# EAGLE design pi-board-v1 (EAGLE 8.7.1)
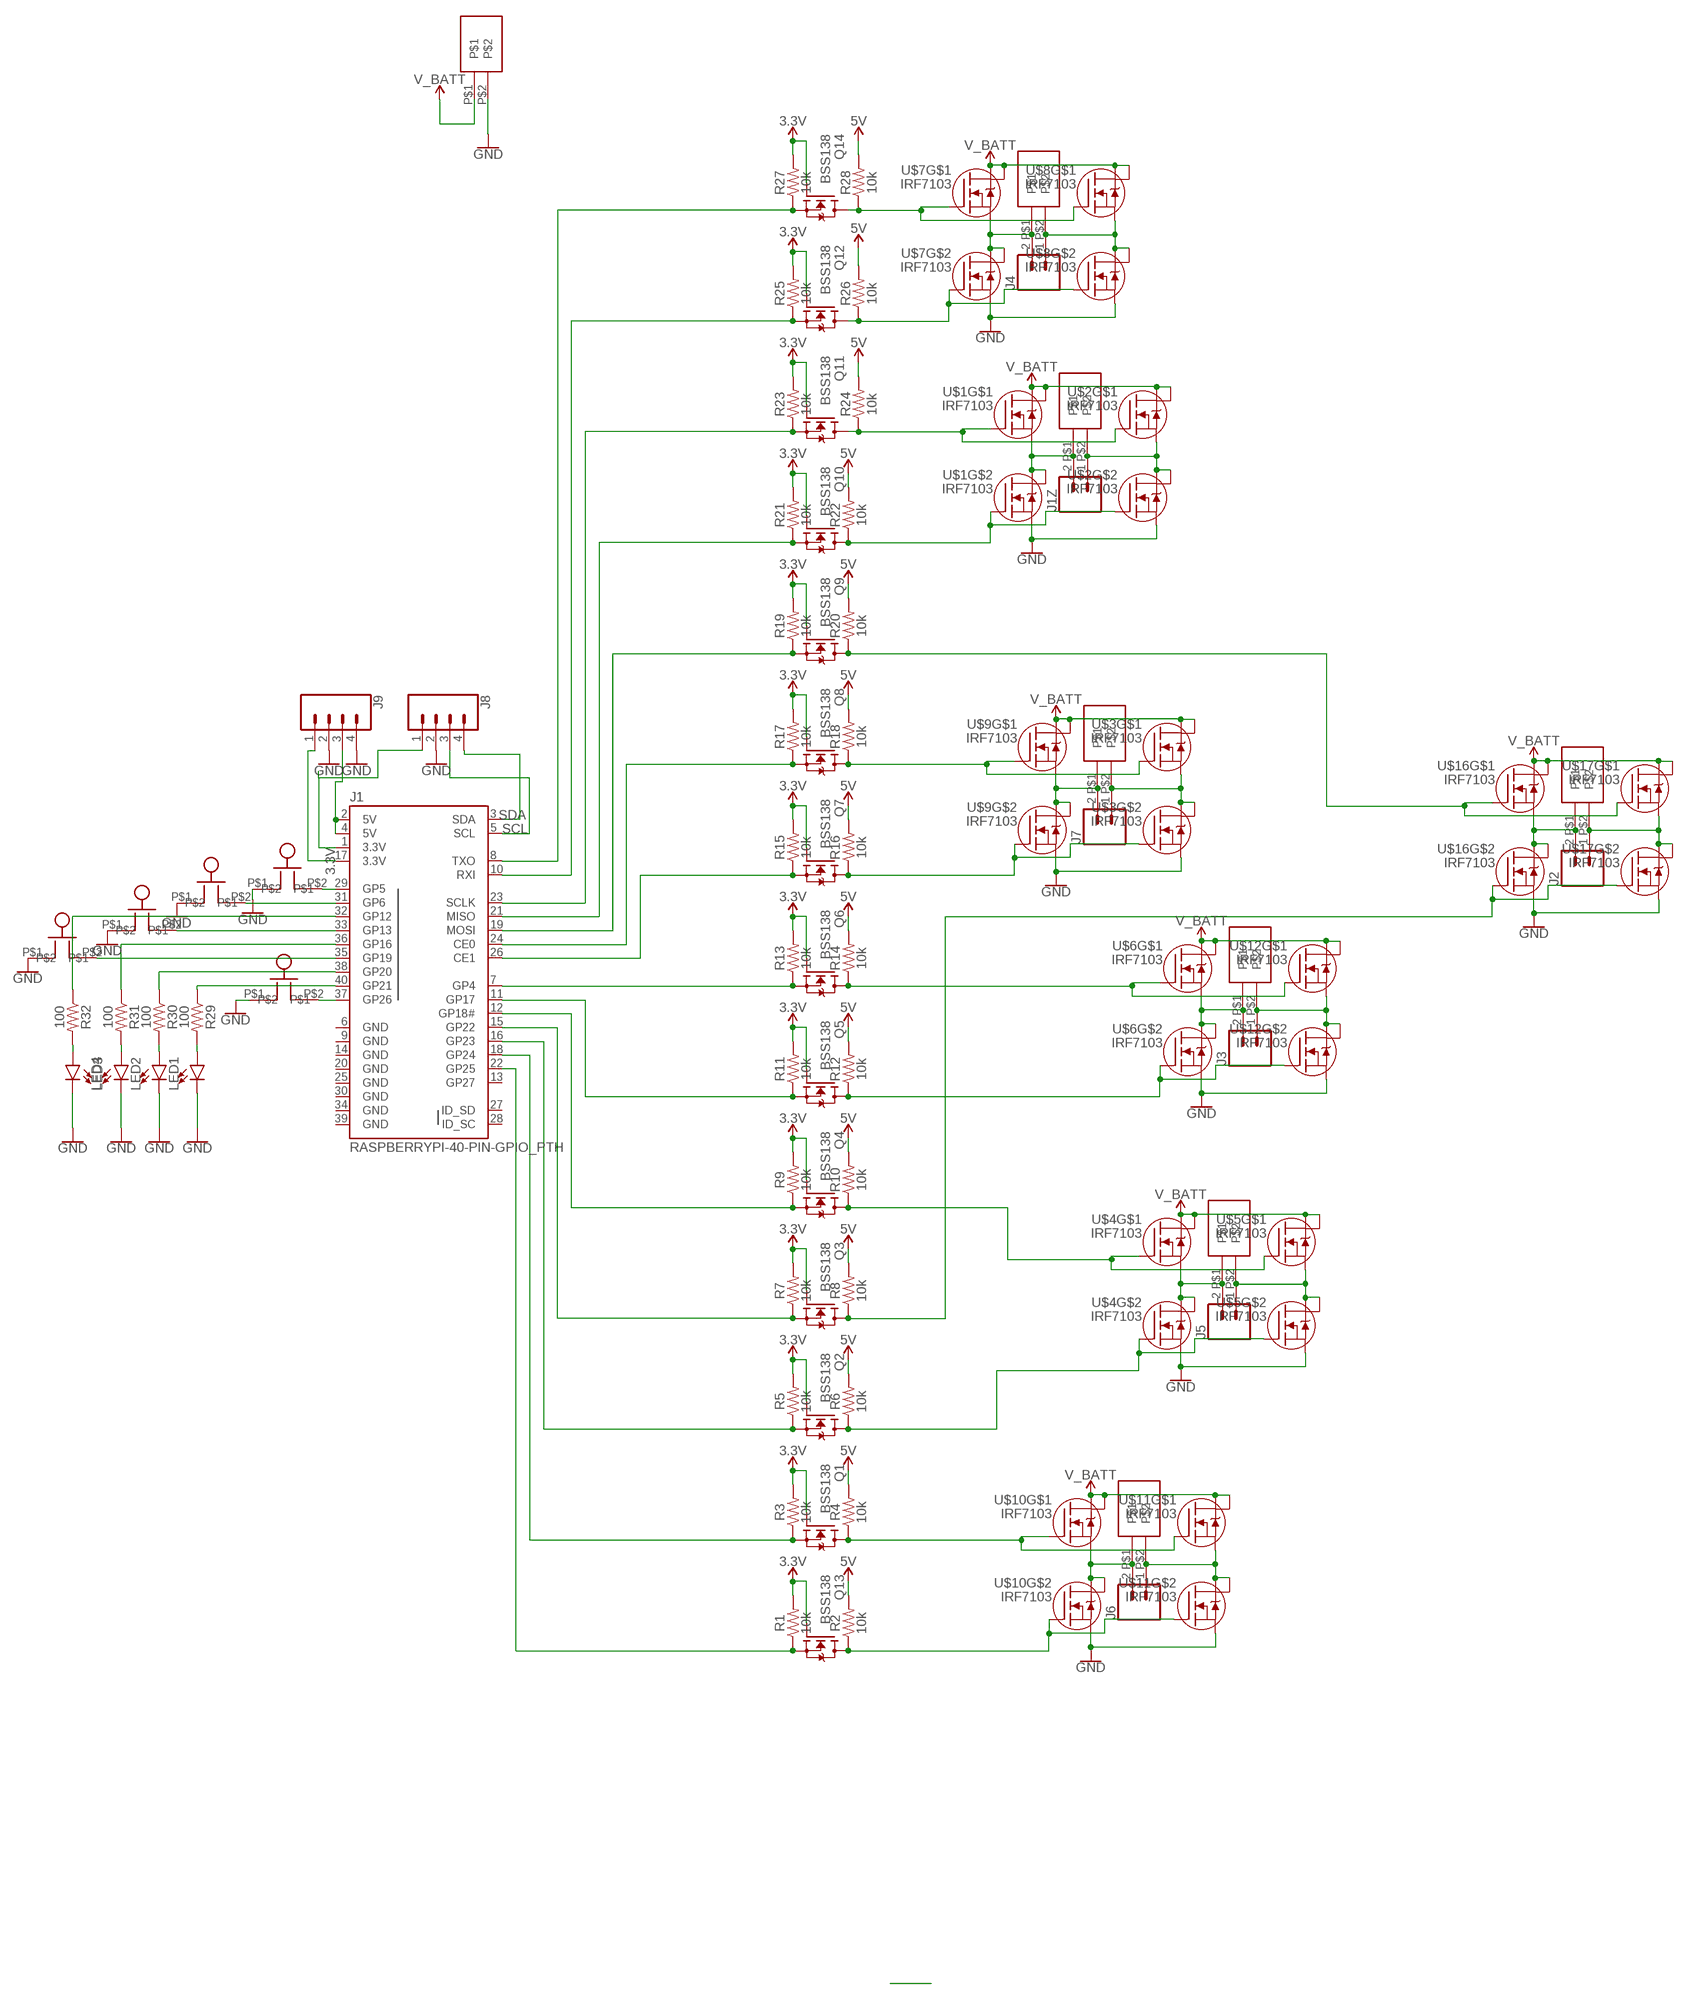
[diagram p0: schematic, sheet 1]

## Parts
B1  BUTTON  [BUTTON]
B2  BUTTON  [BUTTON]
B3  BUTTON  [BUTTON]
B4  BUTTON  [BUTTON]
B5  BUTTON  [BUTTON]
J1  RASPBERRYPI-40-PIN-GPIO_PTH  [2X20_SHROUDED]
J1Z  CONN_02  [1X02]
J2  CONN_02  [1X02]
J3  CONN_02  [1X02]
J4  CONN_02  [1X02]
J5  CONN_02  [1X02]
J6  CONN_02  [1X02]
J7  CONN_02  [1X02]
J8  CONN_04  [1X04]
J9  CONN_04  [1X04]
LED1  LED-3MM-NO_SILK  [LED_3MM-NS]
LED2  LED-3MM-NO_SILK  [LED_3MM-NS]
LED3  LED-3MM-NO_SILK  [LED_3MM-NS]
LED4  LED-3MM-NO_SILK  [LED_3MM-NS]
Q1  BSS138  [SOT23]
Q2  BSS138  [SOT23]
Q3  BSS138  [SOT23]
Q4  BSS138  [SOT23]
Q5  BSS138  [SOT23]
Q6  BSS138  [SOT23]
Q7  BSS138  [SOT23]
Q8  BSS138  [SOT23]
Q9  BSS138  [SOT23]
Q10  BSS138  [SOT23]
Q11  BSS138  [SOT23]
Q12  BSS138  [SOT23]
Q13  BSS138  [SOT23]
Q14  BSS138  [SOT23]
R1  10k  10KOHM-0603-1/10W-1%  [0603]
R2  10k  10KOHM-0603-1/10W-1%  [0603]
R3  10k  10KOHM-0603-1/10W-1%  [0603]
R4  10k  10KOHM-0603-1/10W-1%  [0603]
R5  10k  10KOHM-0603-1/10W-1%  [0603]
R6  10k  10KOHM-0603-1/10W-1%  [0603]
R7  10k  10KOHM-0603-1/10W-1%  [0603]
R8  10k  10KOHM-0603-1/10W-1%  [0603]
R9  10k  10KOHM-0603-1/10W-1%  [0603]
R10  10k  10KOHM-0603-1/10W-1%  [0603]
R11  10k  10KOHM-0603-1/10W-1%  [0603]
R12  10k  10KOHM-0603-1/10W-1%  [0603]
R13  10k  10KOHM-0603-1/10W-1%  [0603]
R14  10k  10KOHM-0603-1/10W-1%  [0603]
R15  10k  10KOHM-0603-1/10W-1%  [0603]
R16  10k  10KOHM-0603-1/10W-1%  [0603]
R17  10k  10KOHM-0603-1/10W-1%  [0603]
R18  10k  10KOHM-0603-1/10W-1%  [0603]
R19  10k  10KOHM-0603-1/10W-1%  [0603]
R20  10k  10KOHM-0603-1/10W-1%  [0603]
R21  10k  10KOHM-0603-1/10W-1%  [0603]
R22  10k  10KOHM-0603-1/10W-1%  [0603]
R23  10k  10KOHM-0603-1/10W-1%  [0603]
R24  10k  10KOHM-0603-1/10W-1%  [0603]
R25  10k  10KOHM-0603-1/10W-1%  [0603]
R26  10k  10KOHM-0603-1/10W-1%  [0603]
R27  10k  10KOHM-0603-1/10W-1%  [0603]
R28  10k  10KOHM-0603-1/10W-1%  [0603]
R29  100  10KOHM-0603-1/10W-1%  [0603]
R30  100  10KOHM-0603-1/10W-1%  [0603]
R31  100  10KOHM-0603-1/10W-1%  [0603]
R32  100  10KOHM-0603-1/10W-1%  [0603]
U$1  IRF7103  [SO8-2]
U$2  IRF7103  [SO8-2]
U$3  IRF7103  [SO8-2]
U$4  IRF7103  [SO8-2]
U$5  IRF7103  [SO8-2]
U$6  IRF7103  [SO8-2]
U$7  IRF7103  [SO8-2]
U$8  IRF7103  [SO8-2]
U$9  IRF7103  [SO8-2]
U$10  IRF7103  [SO8-2]
U$11  IRF7103  [SO8-2]
U$12  IRF7103  [SO8-2]
U$16  IRF7103  [SO8-2]
U$17  IRF7103  [SO8-2]
U$22  SPRING-TERMINAL  [SPRING-TERMINAL]
X1  SPRING-TERMINAL  [SPRING-TERMINAL]
X2  SPRING-TERMINAL  [SPRING-TERMINAL]
X3  SPRING-TERMINAL  [SPRING-TERMINAL]
X4  SPRING-TERMINAL  [SPRING-TERMINAL]
X5  SPRING-TERMINAL  [SPRING-TERMINAL]
X6  SPRING-TERMINAL  [SPRING-TERMINAL]
X7  SPRING-TERMINAL  [SPRING-TERMINAL]

## Nets
3.3V: J1.1(3.3V) J1.17(3.3V) J8.1 J9.1 Q1.1(G) Q2.1(G) Q3.1(G) Q4.1(G) Q5.1(G) Q6.1(G) Q7.1(G) Q8.1(G) Q9.1(G) Q10.1(G) Q11.1(G) Q12.1(G) Q13.1(G) Q14.1(G) R1.2 R3.2 R5.2 R7.2 R9.2 R11.2 R13.2 R15.2 R17.2 R19.2 R21.2 R23.2 R25.2 R27.2
5V: J1.2(5V) J1.4(5V) J9.3 R2.2 R4.2 R6.2 R8.2 R10.2 R12.2 R14.2 R16.2 R18.2 R20.2 R22.2 R24.2 R26.2 R28.2
GND: B1.P$1 B2.P$1 B3.P$1 B4.P$1 B5.P$1 J8.2 J9.2 J9.4 LED1.K(C) LED2.K(C) LED3.K(C) LED4.K(C) U$1.3(S) U$2.3(S) U$3.3(S) U$4.3(S) U$5.3(S) U$6.3(S) U$7.3(S) U$8.3(S) U$9.3(S) U$10.3(S) U$11.3(S) U$12.3(S) U$16.3(S) U$17.3(S) U$22.P$2
N$1: J1.22(GP25) Q13.2(S) R1.1
N$2: Q11.3(D) R24.1 U$1.2(G) U$2.2(G)
N$3: J1.18(GP24) Q1.2(S) R3.1
N$4: J1Z.2 U$1.1(S) U$1.5(D) U$1.6(D) X1.P$1
N$5: J1.16(GP23) Q2.2(S) R5.1
N$6: J1Z.1 U$2.1(S) U$2.5(D) U$2.6(D) X1.P$2
N$7: J1.15(GP22) Q3.2(S) R7.1
N$8: Q3.3(D) R8.1 U$16.4(G) U$17.4(G)
N$9: Q8.3(D) R18.1 U$3.2(G) U$9.2(G)
N$10: Q12.3(D) R26.1 U$7.4(G) U$8.4(G)
N$11: J1.11(GP17) Q5.2(S) R11.1
N$12: Q5.3(D) R12.1 U$6.4(G) U$12.4(G)
N$13: J1.7(GP4) Q6.2(S) R13.1
N$14: Q10.3(D) R22.1 U$1.4(G) U$2.4(G)
N$15: J1.26(CE1) Q7.2(S) R15.1
N$16: B5.P$2 J1.37(GP26)
N$17: J1.24(CE0) Q8.2(S) R17.1
N$18: J7.2 U$9.1(S) U$9.5(D) U$9.6(D) X7.P$1
N$19: J1.19(MOSI) Q9.2(S) R19.1
N$20: Q9.3(D) R20.1 U$16.2(G) U$17.2(G)
N$21: J1.21(MISO) Q10.2(S) R21.1
N$22: J5.2 U$4.1(S) U$4.5(D) U$4.6(D) X5.P$1
N$23: J1.23(SCLK) Q11.2(S) R23.1
N$24: J7.1 U$3.1(S) U$3.5(D) U$3.6(D) X7.P$2
N$25: J1.10(RXI) Q12.2(S) R25.1
N$26: J5.1 U$5.1(S) U$5.5(D) U$5.6(D) X5.P$2
N$27: J1.8(TXO) Q14.2(S) R27.1
N$28: Q14.3(D) R28.1 U$7.2(G) U$8.2(G)
N$29: Q7.3(D) R16.1 U$3.4(G) U$9.4(G)
N$30: B4.P$2 J1.35(GP19)
N$31: B3.P$2 J1.33(GP13)
N$32: J1.12(GP18#) Q4.2(S) R9.1
N$33: Q6.3(D) R14.1 U$6.2(G) U$12.2(G)
N$34: Q4.3(D) R10.1 U$4.2(G) U$5.2(G)
N$35: Q13.3(D) R2.1 U$10.4(G) U$11.4(G)
N$36: Q2.3(D) R6.1 U$4.4(G) U$5.4(G)
N$37: J6.2 U$10.1(S) U$10.5(D) U$10.6(D) X6.P$1
N$38: J4.2 U$7.1(S) U$7.5(D) U$7.6(D) X4.P$1
N$39: J4.1 U$8.1(S) U$8.5(D) U$8.6(D) X4.P$2
N$40: J6.1 U$11.1(S) U$11.5(D) U$11.6(D) X6.P$2
N$41: J2.2 U$16.1(S) U$16.5(D) U$16.6(D) X2.P$1
N$42: J2.1 U$17.1(S) U$17.5(D) U$17.6(D) X2.P$2
N$43: B1.P$2 J1.29(GP5)
N$44: B2.P$2 J1.31(GP6)
N$46: Q1.3(D) R4.1 U$10.2(G) U$11.2(G)
N$47: J3.2 U$6.1(S) U$6.5(D) U$6.6(D) X3.P$1
N$48: J3.1 U$12.1(S) U$12.5(D) U$12.6(D) X3.P$2
N$49: LED4.A R32.2
N$50: LED3.A R31.2
N$51: LED2.A R30.2
N$52: LED1.A R29.2
N$53: J1.40(GP21) R29.1
N$54: J1.38(GP20) R30.1
N$55: J1.36(GP16) R31.1
N$56: J1.32(GP12) R32.1
SCL: J1.5(SCL) J8.3
SDA: J1.3(SDA) J8.4
V_BATT: U$1.7(D) U$1.8(D) U$2.7(D) U$2.8(D) U$3.7(D) U$3.8(D) U$4.7(D) U$4.8(D) U$5.7(D) U$5.8(D) U$6.7(D) U$6.8(D) U$7.7(D) U$7.8(D) U$8.7(D) U$8.8(D) U$9.7(D) U$9.8(D) U$10.7(D) U$10.8(D) U$11.7(D) U$11.8(D) U$12.7(D) U$12.8(D) U$16.7(D) U$16.8(D) U$17.7(D) U$17.8(D) U$22.P$1
Unconnected: J1.13(GP27) J1.27(ID_SD) J1.28(ID_SC)

## Power pins joined to a net without a drawn wire
GND: J1.6(GND) J1.9(GND) J1.14(GND) J1.20(GND) J1.25(GND) J1.30(GND) J1.34(GND) J1.39(GND)

## Library data of the parts
B1-B5 = spietz-library-2:BUTTON
J1 = SparkFun-Connectors:RASPBERRYPI-40-PIN-GPIO: Raspberry Pi GPIO Header 2x20 pin connector, as found on B, B+, A+ models. Both shrouded PTH and SMT versions available. SparkFun Products: GPIO Shrouded Header <https://www.sparkfun.com/products/13054>- PTH SparkFun Pi Wedge (Preassembled) <https://www.sparkfun.com/products/13717>; PROD_ID: CONN-12263; SF_ID: PRT-13054
J1Z J2-J7 = SparkFun-Connectors:CONN_02: Multi connection point. Often used as Generic Header-pin footprint for 0.1 inch spaced/style header connections On any of the 0.1 inch spaced packages, you can populate with these: Break Away Headers - Straight <https://www.sparkfun.com/products/116> (PRT-00116) Break Away Male Headers - Right Angle <https://www.sparkfun.com/products/553> (PRT-00553) Female Headers <https://www.sparkfun.com/products/115> (PRT-00115) Break Away Headers - Machine Pin <https://www.sparkfun.com/products/117> (PRT-00117) Break Away Female Headers - Swiss Machine Pin <https://www.sparkfun.com/products/743> (PRT-00743) For SCREWTERMINALS and SPRING TERMINALS visit here: Screw Terimnals on SparkFun.com <https://www.sparkfun.com/search/results?term=Screw+Terminals> (5mm/3.5mm/2.54mm spacing) This device is also useful as a general connection point to wire up your design to another part of your project. Our various solder wires solder well into these plated through hole pads. Hook-Up Wire - Assortment (Stranded, 22 AWG) <https://www.sparkfun.com/products/11375> (PRT-11375) Hook-Up Wire - Assortment (Solid Core, 22 AWG) <https://www.sparkfun.com/products/11367> (PRT-11367) View the entire wire category on our website here <https://www.sparkfun.com/categories/141> Special notes: Molex polarized connector foot print use with: PRT-08233 with associated crimp pins and housings. 2.54_SCREWTERM for use with PRT-10571. 3.5mm Screw Terminal footprints for PRT-08084 5mm Screw Terminal footprints for use with PRT-08432
J8 J9 = SparkFun-Connectors:CONN_04: Multi connection point. Often used as Generic Header-pin footprint for 0.1 inch spaced/style header connections On any of the 0.1 inch spaced packages, you can populate with these: Break Away Headers - Straight <https://www.sparkfun.com/products/116> (PRT-00116) Break Away Male Headers - Right Angle <https://www.sparkfun.com/products/553> (PRT-00553) Female Headers <https://www.sparkfun.com/products/115> (PRT-00115) Break Away Headers - Machine Pin <https://www.sparkfun.com/products/117> (PRT-00117) Break Away Female Headers - Swiss Machine Pin <https://www.sparkfun.com/products/743> (PRT-00743) For SCREWTERMINALS and SPRING TERMINALS visit here: Screw Terimnals on SparkFun.com <https://www.sparkfun.com/search/results?term=Screw+Terminals> (5mm/3.5mm/2.54mm spacing) This device is also useful as a general connection point to wire up your design to another part of your project. Our various solder wires solder well into these plated through hole pads. Hook-Up Wire - Assortment (Stranded, 22 AWG) <https://www.sparkfun.com/products/11375> (PRT-11375) Hook-Up Wire - Assortment (Solid Core, 22 AWG) <https://www.sparkfun.com/products/11367> (PRT-11367) View the entire wire category on our website here <https://www.sparkfun.com/categories/141> Special notes: Molex polarized connector foot print use with SKU : PRT-08231 with associated crimp pins and housings. 1MM SMD Version SKU: PRT-10208; PROD_ID: CONN-09696
LED1-LED4 = SparkFun-LED:LED: LED (Generic) Standard schematic elements and footprints for 5mm, 3mm, 1206, and 0603 sized LEDs. Generic LEDs with no color specified.
Q1-Q14 = bss138_10:BSS138: BSS138 N-Channel Logic Level Enhancement Mode Field Effect Transistor Source: http://www.fairchildsemi.com/datasheets/BS/BSS138.pdf; MF: Fairchild; MPN: BSS138; OC_FARNELL: 9845330; OC_NEWARK: 67R2009
R1-R28 = SparkFun-Resistors:10KOHM: 10kΩ resistor A resistor is a passive two-terminal electrical component that implements electrical resistance as a circuit element. Resistors act to reduce current flow, and, at the same time, act to lower voltage levels within circuits. - Wikipedia; PROD_ID: RES-00824
R29-R32 = SparkFun-Resistors:10KOHM: 10kΩ resistor A resistor is a passive two-terminal electrical component that implements electrical resistance as a circuit element. Resistors act to reduce current flow, and, at the same time, act to lower voltage levels within circuits. - Wikipedia; PROD_ID: RES-00824; VALUE: 10k
U$1-U$12 U$16 U$17 = irf-7103:IRF7103: HEXFET® Power MOSFET Adavanced Process Technology Ultra Low On-Resistance Dual N-Channel MOSFET Surface Mount Available in Tape & Reel Dynamic dv/dt Rating Fast Switching Please connect both Drain-Pins of each FET for thermal Reasons! (Pin 5 with Pin 6, 7 with 8)
U$22 X1-X7 = spietz-library-2:SPRING-TERMINAL

## Board
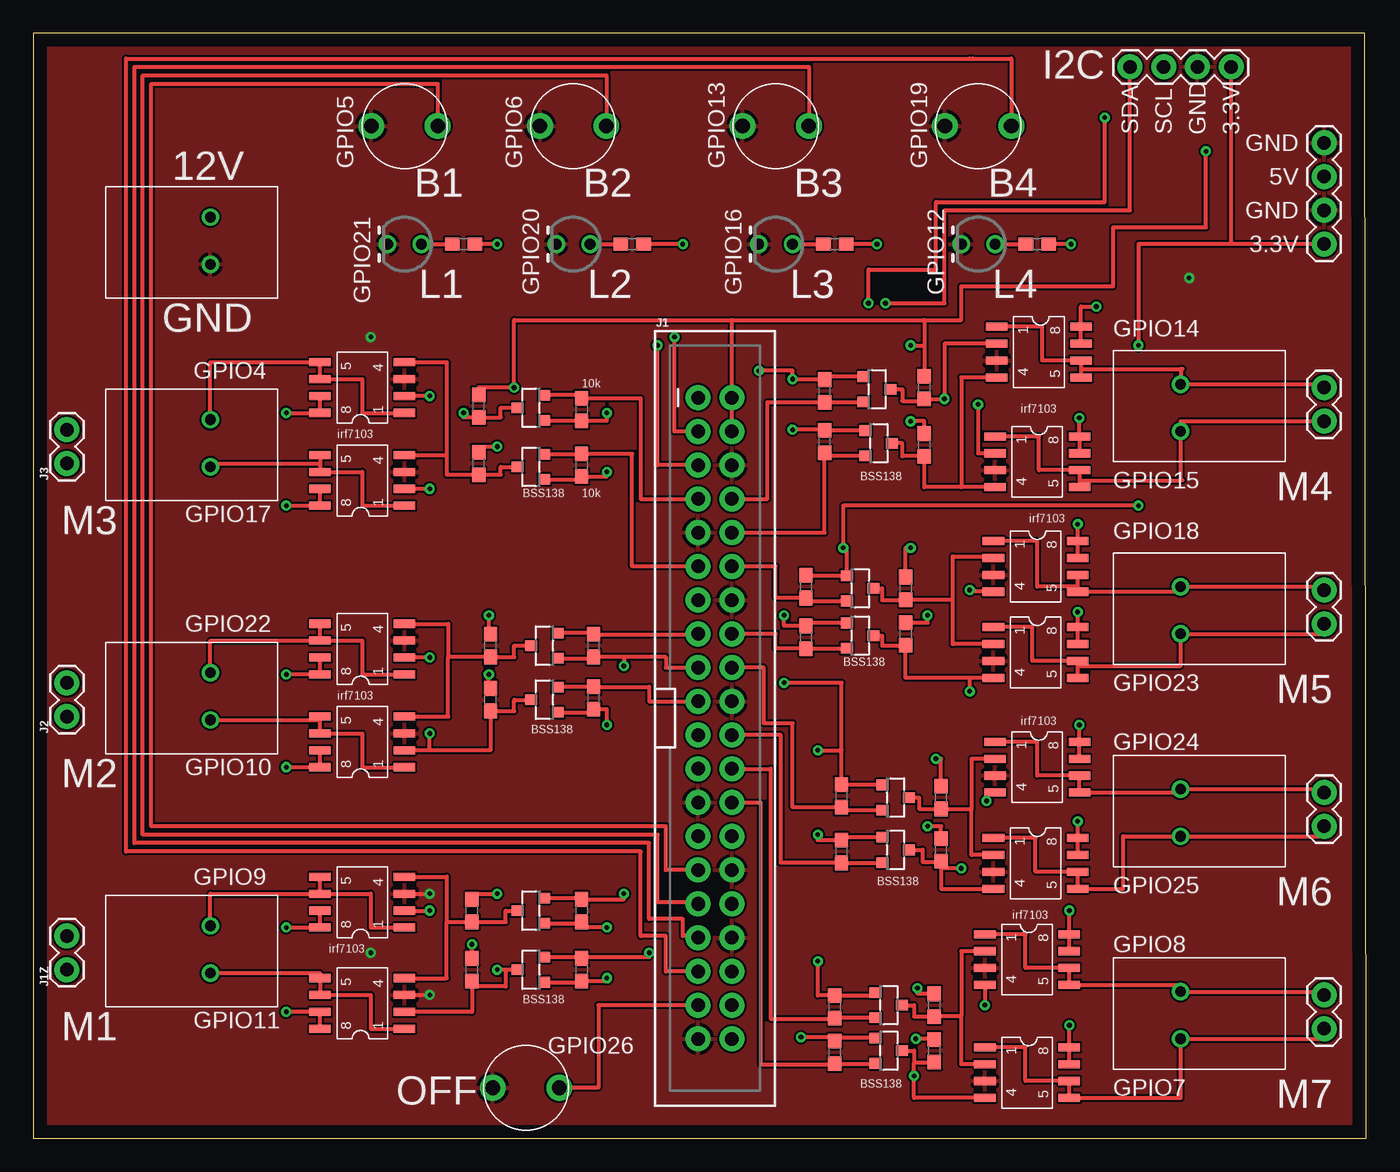
[diagram p1: board, top side]
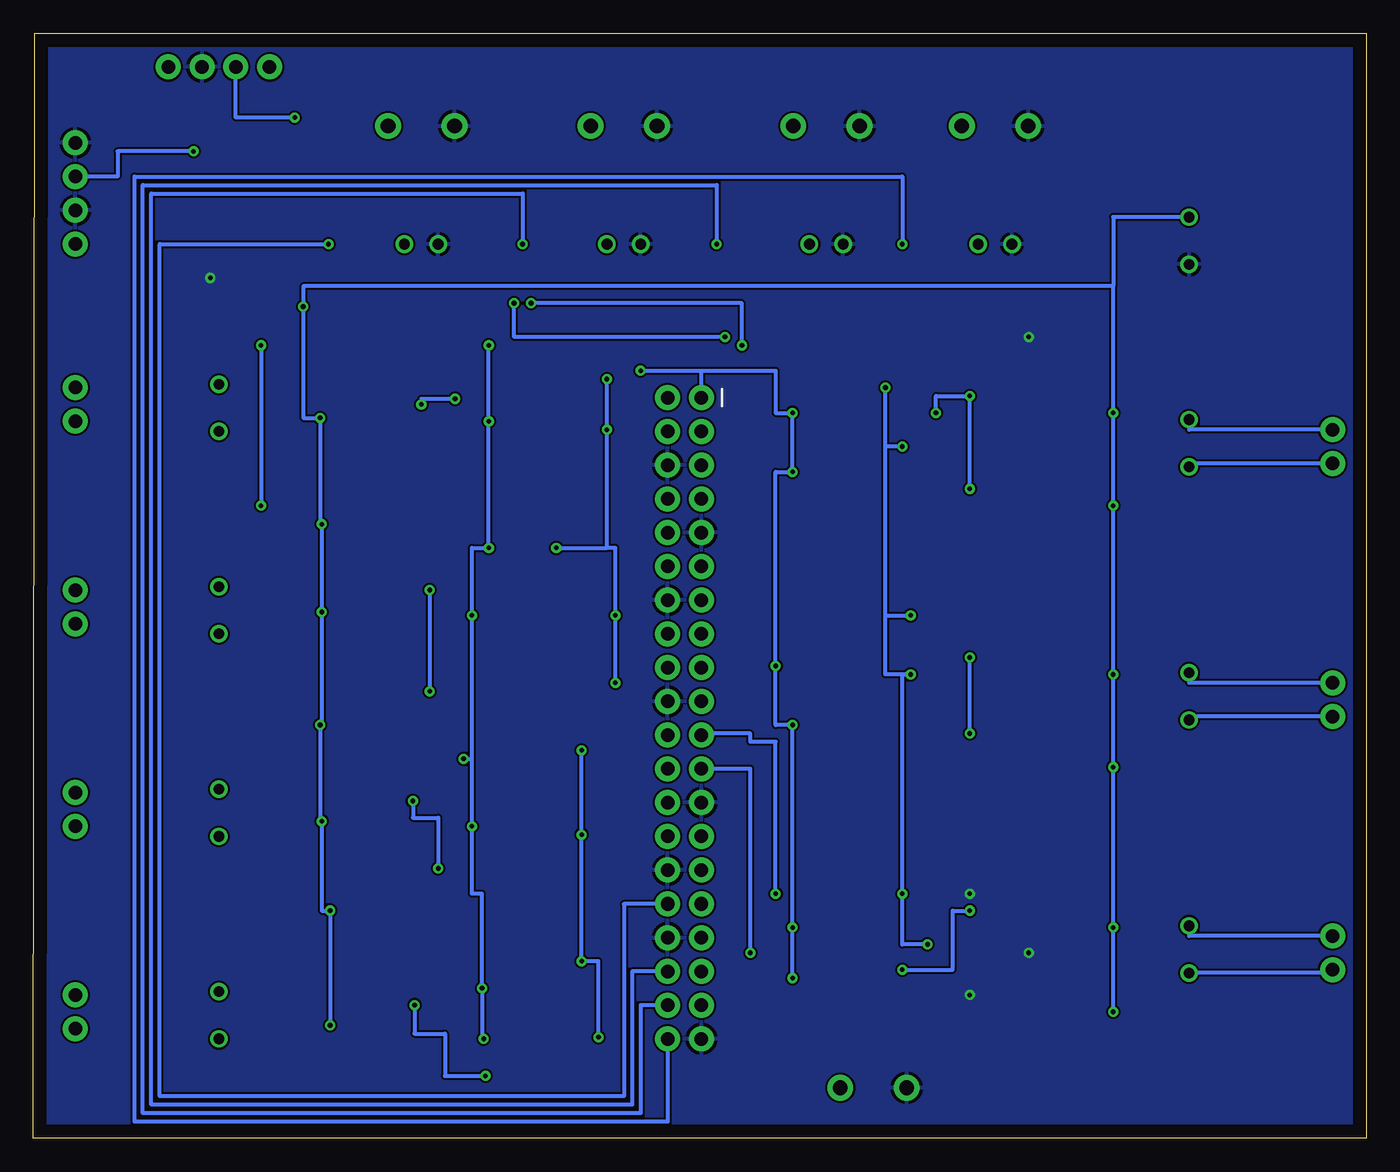
[diagram p2: board, bottom side, seen from below]

Size 100.33 x 83.19 mm. Coordinates in mm from the lower left corner, seen from the top.
Outline: 0,0 100.33,0 100.2,83.19 0,83.19 0,0
Copper layers (1*16): Top 0.035mm / dielectric 1.5mm / Bottom 0.035mm
Design rules "default": minimum track width 6mil, minimum drill 0.35mm, track to track 6mil, track to pad 6mil, pad to pad 6mil, via to via 6mil, smd to smd 6mil, copper to edge 40mil, drill to drill 6mil, minimum pad ring 10mil, minimum via ring 8mil, stop-mask expansion 4mil, vias tented up to drill 0mil, thermal gap 10mil

### Footprints (pad centres in the part's own frame; a part is rotated, then mirrored left to right if it is on the bottom)
BUTTON = drill 1.1 pad 1.93: P$1 -2.499,0; P$2 2.499,0
2X20_SHROUDED = drill 1.016 pad 1.88: 1 -1.27,24.13; 2 1.27,24.13; 3 -1.27,21.59; 4 1.27,21.59; 5 -1.27,19.05; 6 1.27,19.05; 7 -1.27,16.51; 8 1.27,16.51; 9 -1.27,13.97; 10 1.27,13.97; 11 -1.27,11.43; 12 1.27,11.43; 13 -1.27,8.89; 14 1.27,8.89; 15 -1.27,6.35; 16 1.27,6.35; 17 -1.27,3.81; 18 1.27,3.81; 19 -1.27,1.27; 20 1.27,1.27; 21 -1.27,-1.27; 22 1.27,-1.27; 23 -1.27,-3.81; 24 1.27,-3.81; 25 -1.27,-6.35; 26 1.27,-6.35; 27 -1.27,-8.89; 28 1.27,-8.89; 29 -1.27,-11.43; 30 1.27,-11.43; 31 -1.27,-13.97; 32 1.27,-13.97; 33 -1.27,-16.51; 34 1.27,-16.51; 35 -1.27,-19.05; 36 1.27,-19.05; 37 -1.27,-21.59; 38 1.27,-21.59; 39 -1.27,-24.13; 40 1.27,-24.13
1X02 = drill 1.016 pad 1.88: 1 0,0; 2 2.54,0
1X04 = drill 1.016 pad 1.88: 1 0,0; 2 2.54,0; 3 5.08,0; 4 7.62,0
LED_3MM-NS = drill 0.813: A -1.27,0; K 1.27,0
SOT23 = smd 0.8 x 0.9: 1 -0.95,-1; 2 0.95,-1; 3 0,1
0603 = smd 1.1 x 1: 1 -0.85,0; 2 0.85,0
SO8-2 = smd 0.61 x 1.626: 1 -2.54,-2.54; 2 -1.27,-2.54; 3 0,-2.54; 4 1.27,-2.54; 5 1.27,3.81; 6 0,3.81; 7 -1.27,3.81; 8 -2.54,3.81
SPRING-TERMINAL = drill 0.8: P$1 5.08,1.778; P$2 5.08,5.334

### Placement (x,y rotation side)
B1  27.94,76.2 0 top
B2  40.64,76.2 0 top
B3  55.88,76.2 0 top
B4  71.12,76.2 0 top
B5  37.08,3.81 0 top
J1  51.31,31.62 0 top
J1Z  2.54,12.7 90 top
J2  2.54,31.75 90 top
J3  2.54,50.8 90 top
J4  97.16,56.52 270 top
J5  97.16,41.27 270 top
J6  97.16,26.04 270 top
J7  97.16,10.79 270 top
J8  90.17,80.64 180 top
J9  97.16,67.31 90 top
LED1  27.94,67.31 180 top
LED2  40.64,67.31 180 top
LED3  55.88,67.31 180 top
LED4  71.12,67.31 180 top
Q1  64.9,25.65 270 top
Q2  62.23,37.85 270 top
Q3  38.48,37.08 90 top
Q4  62.23,41.4 270 top
Q5  37.47,50.55 90 top
Q6  37.47,54.99 90 top
Q7  64.39,6.6 270 top
Q8  64.39,10.03 270 top
Q9  38.48,33.02 90 top
Q10  37.47,17.14 90 top
Q11  37.47,12.7 90 top
Q12  63.63,52.32 270 top
Q13  64.9,21.72 270 top
Q14  63.5,56.39 270 top
R1  60.83,21.59 90 top
R2  68.33,21.72 90 top
R3  60.83,25.78 90 top
R4  68.33,25.65 90 top
R5  58.17,37.72 90 top
R6  65.66,37.97 90 top
R7  42.16,37.08 270 top
R8  34.42,37.08 90 top
R9  58.17,41.53 90 top
R10  65.66,41.4 90 top
R11  41.27,50.67 270 top
R12  33.53,50.8 90 top
R13  41.27,54.86 270 top
R14  33.53,55.12 90 top
R15  60.33,6.48 90 top
R16  67.82,6.6 90 top
R17  60.33,9.91 90 top
R18  67.82,10.03 90 top
R19  42.16,33.15 270 top
R20  34.42,33.02 90 top
R21  41.27,17.14 270 top
R22  33.02,17.14 90 top
R23  41.27,12.7 270 top
R24  33.02,12.7 90 top
R25  59.56,52.45 90 top
R26  67.06,52.2 90 top
R27  59.56,56.26 90 top
R28  67.06,56.52 90 top
R29  32.38,67.31 180 top
R30  45.09,67.31 180 top
R31  60.33,67.31 180 top
R32  75.56,67.31 180 top
U$1  25.4,18.41 90 top
U$2  25.4,10.79 90 top
U$3  74.17,12.83 270 top
U$4  74.8,35.94 270 top
U$5  74.8,42.42 270 top
U$6  25.4,57.15 90 top
U$7  74.93,50.29 270 top
U$8  75.06,58.55 270 top
U$9  74.17,4.32 270 top
U$10  74.8,20.07 270 top
U$11  74.93,27.3 270 top
U$12  25.4,50.16 90 top
U$16  25.4,37.47 90 top
U$17  25.4,30.48 90 top
U$22  18.41,71.12 180 top
X1  18.41,17.78 180 top
X2  18.41,36.83 180 top
X3  18.41,55.88 180 top
X4  81.28,51.44 0 top
X5  81.28,36.2 0 top
X6  81.28,20.95 0 top
X7  81.28,5.71 0 top

### Tracks (layer width: path | path; a pad name or v marks a point on that pad's centre or on a via)
3.3V  (via drill 0.35)
  Top 0.305: Q14.1 59.69,57.34 | 59.69,57.34 59.56,57.34 R27.2 | Q12.1 62.63,53.3 R25.2 59.56,53.34 v57.15,53.34 | R9.2 61.23,42.38 Q4.1 61.23,44.45 v60.96,44.45 60.96,47.62 v83.19,47.62 | Q2.1 58.17,38.8 R5.2 56.52,38.57 v56.52,39.37 | Q1.1 60.83,26.6 R3.2 60.83,29.21 | Q13.1 60.83,22.67 R1.2 59.05,22.44 v59.05,22.86 | Q9.1 42.16,32.07 R19.2 43.18,32.3 v43.18,31.11 | Q3.1 42.16,36.13 R7.2 44.45,36.23 | Q5.1 41.27,49.6 R11.2 43.18,49.82 v43.18,50.16 | Q6.1 41.27,54.04 R13.2 43.18,54.01 v43.18,54.61 | Q8.1 63.39,10.76 R17.2 59.05,10.76 v59.05,13.34 | Q7.1 60.33,7.55 R15.2 60.33,7.62 v57.78,7.62 | Q10.1 41.27,16.2 R21.2 41.27,15.88 v43.18,15.88 | Q11.1 41.27,11.75 R23.2 43.18,11.85 v43.18,12.06 | 44.45,36.23 47.62,36.23 47.62,35.43 J1.17 | 44.45,36.23 v44.45,35.56 | 59.69,57.34 59.69,57.15 v57.15,57.15 57.15,57.78 v54.61,57.78 | 60.83,29.21 60.83,34.29 v56.52,34.29 | v59.05,29.21 60.83,29.21 | J9.1 90.17,67.31 | 90.17,67.31 J8.1 | 90.17,67.31 83.19,67.31 v83.19,59.69
  Bottom 0.305: v43.18,12.06 v43.18,15.88 v43.18,31.11 44.45,31.11 v44.45,35.56 44.45,50.16 v43.18,50.16 v43.18,54.61 44.45,54.61 44.45,57.78 50.04,57.78 | v57.15,57.15 v57.15,53.34 57.15,44.45 | v60.96,44.45 57.15,44.45 | 57.15,44.45 56.52,44.45 v56.52,39.37 v56.52,34.29 | v59.05,29.21 v59.05,22.86 v59.05,13.34 57.78,13.34 v57.78,7.62 | v54.61,57.78 50.04,57.78 | J1.1 50.04,57.78 | v83.19,59.69 v83.19,47.62
5V  (via drill 0.35)
  Top 0.305: R16.2 67.82,7.49 v66.42,7.49 | R18.2 66.55,10.88 v66.55,11.3 | R24.2 v33.02,14.61 | R22.2 33.02,18.41 v34.92,18.41 | R20.2 34.29,33.87 v34.29,34.92 | R14.2 33.53,56.52 v36.2,56.52 36.2,61.59 52.58,61.59 | v34.29,39.37 34.29,37.93 R8.2 | 52.58,61.59 67.06,61.59 | 67.06,61.59 67.06,59.69 | 67.06,59.69 R28.2 | R26.2 67.06,53.98 v66.04,53.98 | v66.04,59.69 67.06,59.69 | R10.2 65.66,44.45 v66.04,44.45 | R6.2 67.31,38.82 v67.31,39.37 | R4.2 68.33,28.57 v67.94,28.57 | R2.2 68.33,23.5 v67.31,23.5 | R12.2 33.53,52.07 v34.92,52.07 | J1.4 J1.2 52.58,61.59 | 67.06,61.59 69.85,61.59 69.85,64.14 81.28,64.14 81.28,68.58 88.27,68.58 v88.27,74.3
  Bottom 0.305: v66.42,7.49 66.55,7.49 v66.55,11.3 66.55,18.41 67.31,18.41 v67.31,23.5 67.31,28.57 | v33.02,14.61 34.92,14.61 v34.92,18.41 34.92,34.92 v34.29,34.92 36.2,34.92 36.2,39.37 | 36.2,39.37 36.2,52.07 | 36.2,52.07 v36.2,56.52 | 36.2,39.37 v34.29,39.37 | v66.04,59.69 v66.04,53.98 v66.04,44.45 67.31,44.45 v67.31,39.37 67.31,28.57 | v67.94,28.57 67.31,28.57 | v34.92,52.07 36.2,52.07 | v88.27,74.3 93.98,74.3 93.98,72.39 J9.3
GND  (via drill 0.35)
  Top 0.305: U$2.3 v29.84,10.79 | U$1.3 v29.84,18.41
  other vias: 25.4,60.33 25.4,13.97 87,64.77
  pour Bottom: 0,0 0,83.19 100.33,83.19 100.33,0
  pour Top: 0,0 0,83.19 100.33,83.19 100.33,0
N$1
  Top 0.305: Q13.2 63.9,20.74 R1.1 56.26,20.74 56.26,30.35 J1.22
N$2  (via drill 0.35)
  Top 0.305: Q11.3 35.56,12.7 | 35.56,12.7 35.56,11.43 33.02,11.43 R24.1 33.02,9.53 U$2.2 | U$1.2 v29.84,17.14 | 35.56,12.7 v34.92,12.7
  Bottom 0.305: v34.92,12.7 31.11,12.7 31.11,17.14 v29.84,17.14
N$3
  Top 0.305: Q1.2 60.83,24.7 R3.1 57.15,24.93 57.15,31.24 54.99,31.24 54.99,35.43 J1.18
N$4
  Top 0.305: X1.P$1 13.34,18.41 U$1.6 | U$1.6 U$1.5 | U$1.6 25.4,18.41 25.4,15.88 U$1.1
  Bottom 0.305: J1Z.2 13.34,15.24 X1.P$1
N$5
  Top 0.305: Q2.2 61.23,36.87 R5.1 55.88,36.87 55.88,37.97 J1.16
N$6
  Top 0.305: 2.54,12.45 J1Z.1 | X1.P$2 21.59,12.45 U$2.5 U$2.6 25.4,10.79 25.4,8.26 U$2.1
  Bottom 0.305: J1Z.1 2.54,12.45 X1.P$2
N$7
  Top 0.305: Q3.2 42.16,38.03 R7.1 50.04,37.93 J1.15
N$8
  Top 0.305: Q3.3 36.2,37.08 36.2,36.23 R8.1 31.24,36.23 | 31.24,36.23 31.24,31.75 U$17.4 | U$16.4 31.24,38.73 31.24,36.23
N$9
  Top 0.305: Q8.3 66.29,10.03 66.29,9.18 R18.1 69.85,9.18 | U$9.2 69.85,5.59 69.85,9.18 | U$3.2 69.85,14.1 69.85,9.18
N$10
  Top 0.305: Q12.3 65.41,52.32 65.41,51.35 R26.1 67.06,49.02 69.85,49.02 | U$7.4 69.85,49.02 | U$8.4 69.85,57.28 69.85,49.02
N$11
  Top 0.305: Q5.2 38.47,51.52 R11.1 45.09,51.52 45.09,43.05 J1.11
N$12
  Top 0.305: Q5.3 35.18,50.55 35.18,49.95 R12.1 31.11,49.95 31.11,51.44 | U$12.4 31.11,51.44 | U$6.4 31.11,58.42 31.11,51.44
N$13
  Top 0.305: Q6.2 41.27,55.94 R13.1 45.72,55.71 45.72,48.13 J1.7
N$14
  Top 0.305: Q10.3 35.56,17.14 35.56,16.3 R22.1 31.11,16.3 | U$1.4 31.11,19.68 31.11,16.3 | U$2.4 31.11,12.06 31.11,16.3
N$15
  Top 0.305: Q7.2 63.39,5.63 R15.1 60.33,5.59 54.74,5.59 54.74,25.27 J1.26
N$16
  Top 0.305: J1.37 42.55,10.03 42.55,3.81 B5.P$2
N$17
  Top 0.305: Q8.2 60.33,9.08 R17.1 60.33,9.02 55.5,9.02 55.5,27.81 J1.24
N$18
  Top 0.305: U$9.1 74.68,6.86 74.68,4.32 U$9.6 U$9.5 86.36,3.05 X7.P$1 97.16,7.49 J7.2
N$19
  Top 0.305: Q9.2 39.48,34 R19.1 46.35,34 46.35,32.89 J1.19
N$20  (via drill 0.35)
  Top 0.305: Q9.3 36.2,33.02 36.2,32.17 R20.1 34.42,29.21 29.84,29.21 | 29.84,29.21 U$17.2 | 29.84,29.21 v29.84,30.48 | v29.84,36.2 U$16.2
  Bottom 0.305: v29.84,30.48 v29.84,36.2
N$21  (via drill 0.35)
  Top 0.305: Q10.2 41.27,18.09 R21.1 44.45,18 v44.45,18.41
  Bottom 0.305: v44.45,18.41 44.45,29.84 46.35,29.84 46.35,30.48 50.04,30.48 J1.21
N$22
  Top 0.305: U$4.5 78.61,35.56 | 78.61,35.56 U$4.6 75.18,35.94 75.18,38.48 U$4.1 | J5.2 97.16,37.97 X5.P$1 86.36,35.56 78.61,35.56
N$23  (via drill 0.35)
  Top 0.305: J1.23 50.04,27.77 | Q11.2 41.27,13.65 | 41.27,13.65 R23.1 | 41.27,13.65 46.35,13.65 v46.35,13.97
  Bottom 0.305: v46.35,13.97 46.35,27.81 J1.23
N$24
  Top 0.305: U$3.1 74.68,15.37 74.68,12.83 U$3.6 U$3.5 86.49,11.56 X7.P$2 97.16,11.05 J7.1
N$25
  Top 0.305: Q12.2 59.56,51.37 R25.1 59.56,45.59 J1.10
N$26
  Top 0.305: 78.61,41.53 U$5.5 86.36,41.15 X5.P$2 97.16,41.53 J5.1 | 78.61,41.53 U$5.6 | 78.61,41.53 75.56,41.53 75.56,44.96 U$5.1
N$27
  Top 0.305: 59.56,55.5 R27.1 | R27.1 62.5,55.41 Q14.2 | J1.8 55.24,48.13 55.24,55.41 R27.1
N$28  (via drill 0.35)
  Top 0.305: Q14.3 65.41,56.39 65.41,55.5 67.06,55.5 R28.1 v68.58,55.66 68.58,59.82 U$8.2 | U$7.2 71.12,51.56 v71.12,55.24
  Bottom 0.305: v68.58,55.66 71.12,55.66 v71.12,55.24
N$29  (via drill 0.35)
  Top 0.305: Q7.3 66.29,6.6 66.29,5.71 | 66.29,5.71 67.82,5.71 R16.1 | U$9.4 66.29,3.05 v66.29,4.7 66.29,5.71 | U$3.4 v71.63,10.03
  Bottom 0.305: v71.63,10.03 71.63,7.87 69.34,7.87 69.34,4.7 v66.29,4.7
N$30
  Top 0.305: J1.35 47.62,12.57 47.62,15.24 45.72,15.24 45.72,21.59 6.99,21.59 6.99,81.28 70.48,81.28 70.7,81.28 73.62,81.28 B4.P$2
N$31
  Top 0.305: J1.33 50.04,15.24 48.9,15.24 48.9,16.51 46.35,16.51 46.35,22.23 7.62,22.23 7.62,80.64 55.24,80.64 55.59,80.64 58.38,80.64 B3.P$2
N$32
  Top 0.305: J1.12 55.88,43.05 55.88,40.68 R9.1 58.17,40.45 Q4.2
N$33  (via drill 0.35)
  Top 0.305: Q6.3 35.18,54.99 35.18,54.27 R14.1 32.38,54.27 v32.38,54.61 | v29.84,55.88 U$6.2 | U$12.2 v29.84,48.9
  Bottom 0.305: v32.38,54.61 32.38,55.88 v29.84,55.88 v29.84,48.9
N$34
  Top 0.305: Q4.3 63.88,41.4 63.88,40.51 65.66,40.51 R10.1 69.22,40.55 | 69.22,40.55 69.22,43.81 72.26,43.81 U$5.2 | U$4.2 69.22,37.21 69.22,40.55
N$35  (via drill 0.35)
  Top 0.305: Q13.3 66.93,21.72 66.93,20.83 68.33,20.83 R2.1 | R2.1 68.33,18.8 U$10.4 | U$11.4 71.75,26.04 v71.75,25.4 | v69.85,20.32 68.33,20.32 R2.1
  Bottom 0.305: v71.75,25.4 71.75,24.13 69.85,24.13 v69.85,20.32
N$36  (via drill 0.35)
  Top 0.305: Q2.3 63.88,37.85 63.88,37.08 65.66,37.08 | 65.66,37.08 R6.1 | U$4.4 70.48,34.67 | 70.48,34.67 65.66,34.67 65.66,37.08 | U$5.4 70.48,41.15 v70.48,41.27 | v70.48,33.66 70.48,34.67
  Bottom 0.305: v70.48,41.27 v70.48,33.66
N$37
  Top 0.305: U$10.1 75.44,22.61 75.44,20.07 U$10.6 U$10.5 82.04,18.8 82.04,22.73 X6.P$1 97.16,22.73 J6.2
N$38
  Top 0.305: 78.74,49.53 U$7.6 75.69,50.29 75.69,52.83 U$7.1 | 78.74,49.53 U$7.5 | 78.74,49.53 86.36,49.53 | 86.49,49.53 86.36,49.53 | 86.36,49.53 X4.P$1 86.36,53.98 J4.2
N$39
  Top 0.305: 78.87,57.91 U$8.6 75.95,58.55 75.95,61.09 U$8.1 | 78.87,57.91 U$8.5 | 78.87,57.91 86.36,57.91 | 86.49,57.91 86.36,57.91 | 86.36,57.91 X4.P$2 97.16,56.77 J4.1
N$40
  Top 0.305: U$11.1 75.56,29.84 75.56,27.3 U$11.6 U$11.5 86.36,26.04 X6.P$2 97.16,26.29 J6.1
N$41
  Top 0.305: X2.P$1 13.34,37.47 U$16.6 | U$16.6 U$16.5 | U$16.6 24.77,37.47 24.77,34.92 U$16.1
  Bottom 0.305: J2.2 13.34,34.29 X2.P$1
N$42
  Top 0.305: 13.34,31.75 X2.P$2 21.59,31.5 U$17.5 U$17.6 24.77,30.48 24.77,27.94 U$17.1
  Bottom 0.305: J2.1 13.34,31.75 X2.P$2
N$43
  Top 0.305: J1.29 47.62,20.19 47.62,23.5 8.89,23.5 8.89,79.38 30.44,79.38 B1.P$2
N$44
  Top 0.305: J1.31 50.04,17.78 46.99,17.78 46.99,22.86 8.26,22.86 8.26,80.01 43.14,80.01 B2.P$2
N$46
  Top 0.305: Q1.3 66.67,25.65 66.67,24.8 R4.1 68.33,24.77 70.61,24.77 | U$10.2 70.61,21.34 70.61,24.77 | U$11.2 70.61,28.57 70.61,24.77
N$47
  Top 0.305: X3.P$1 13.34,58.42 U$6.5 U$6.6 24.77,57.15 24.77,54.61 U$6.1
  Bottom 0.305: J3.2 13.34,53.34 X3.P$1
N$48
  Top 0.305: U$12.5 21.59,50.8 | 21.59,50.8 U$12.6 24.77,50.16 24.77,47.62 U$12.1 | X3.P$2 13.34,50.8 21.59,50.8
  Bottom 0.305: J3.1 13.34,50.8 X3.P$2
N$49
  Top 0.305: LED4.A R32.2
N$50
  Top 0.305: LED3.A R31.2
N$51
  Top 0.305: LED2.A R30.2
N$52
  Top 0.305: LED1.A R29.2
N$53  (via drill 0.35)
  Top 0.305: v34.92,67.31 R29.1
  Bottom 0.305: J1.40 52.58,1.27 92.71,1.27 92.71,72.39 34.92,72.39 v34.92,67.31
N$54  (via drill 0.35)
  Top 0.305: v48.9,67.31 R30.1
  Bottom 0.305: J1.38 54.61,10.03 54.61,1.91 92.08,1.91 92.08,71.75 48.9,71.75 v48.9,67.31
N$55  (via drill 0.35)
  Top 0.305: v63.5,67.31 R31.1
  Bottom 0.305: J1.36 55.24,12.57 55.24,2.54 91.44,2.54 91.44,71.12 63.5,71.12 v63.5,67.31
N$56  (via drill 0.35)
  Top 0.305: v78.11,67.31 R32.1
  Bottom 0.305: J1.32 55.88,17.65 55.88,3.17 90.81,3.17 90.81,67.31 v78.11,67.31
SCL  (via drill 0.35)
  Top 0.305: J1.5 46.99,50.67 v46.99,59.69 | v62.87,62.87 62.87,65.41 67.94,65.41 67.94,70.48 80.64,70.48 v80.64,76.83
  Bottom 0.305: v46.99,59.69 46.99,62.87 v62.87,62.87 | v80.64,76.83 85.09,76.83 J8.3
SDA  (via drill 0.35)
  Top 0.305: J1.3 48.26,53.21 v48.26,60.33 | v64.14,62.87 68.58,62.87 68.58,69.85 82.55,69.85 J8.4
  Bottom 0.305: v48.26,60.33 64.14,60.33 v64.14,62.87
V_BATT  (via drill 0.35)
  Top 0.305: U$8.7 U$8.8 78.87,62.61 v80.01,62.61 | U$7.7 U$7.8 v78.74,54.23 | U$5.7 U$5.8 v78.61,46.23 | U$11.7 U$11.8 v78.74,31.11 | U$4.7 U$4.8 v78.61,39.62 | U$9.7 U$9.8 v77.98,8.51 | U$3.7 U$3.8 v77.98,17.14 | U$10.7 U$10.8 v78.61,23.88 | U$1.7 U$1.8 v19.05,15.88 | U$2.8 U$2.7 v19.05,9.53 | U$17.7 U$17.8 v19.05,27.94 | U$16.7 U$16.8 v19.05,34.92 | U$12.7 U$12.8 v19.05,47.62 | U$6.7 U$6.8 v19.05,54.61
  Bottom 0.305: v77.98,8.51 v77.98,17.14 78.61,17.14 v78.61,23.88 78.74,23.88 v78.74,31.11 78.61,31.11 v78.61,39.62 v78.61,46.23 78.74,46.23 v78.74,54.23 80.01,54.23 v80.01,62.61 80.01,64.14 19.05,64.14 | v19.05,9.53 v19.05,15.88 v19.05,27.94 v19.05,34.92 v19.05,47.62 v19.05,54.61 19.05,64.14 | U$22.P$1 19.05,69.34 19.05,64.14

### Text on the board
tPlace: I2C | SDA | SCL | GND | 3.3V | GND | 12V | GPIO5 | B1 | GPIO6 | B2 | GPIO13 | B3 | GPIO19 | B4 | 5V | GND | 3.3V | L1 | L2 | L3 | L4 | GPIO20 | GPIO16 | GPIO12 | GND | GPIO21 | GPIO14 | GPIO4 | 10k | irf7103 | irf7103 | BSS138 | M4 | GPIO15 | M3 | BSS138 | 10k | GPIO17 | irf7103 | GPIO18 | GPIO22 | BSS138 | M5 | GPIO23 | irf7103 | irf7103 | BSS138 | M2 | GPIO24 | GPIO10 | M6 | GPIO9 | BSS138 | GPIO25 | irf7103 | irf7103 | GPIO8 | M1 | BSS138 | GPIO11 | GPIO26 | BSS138 | M7 | OFF | GPIO7